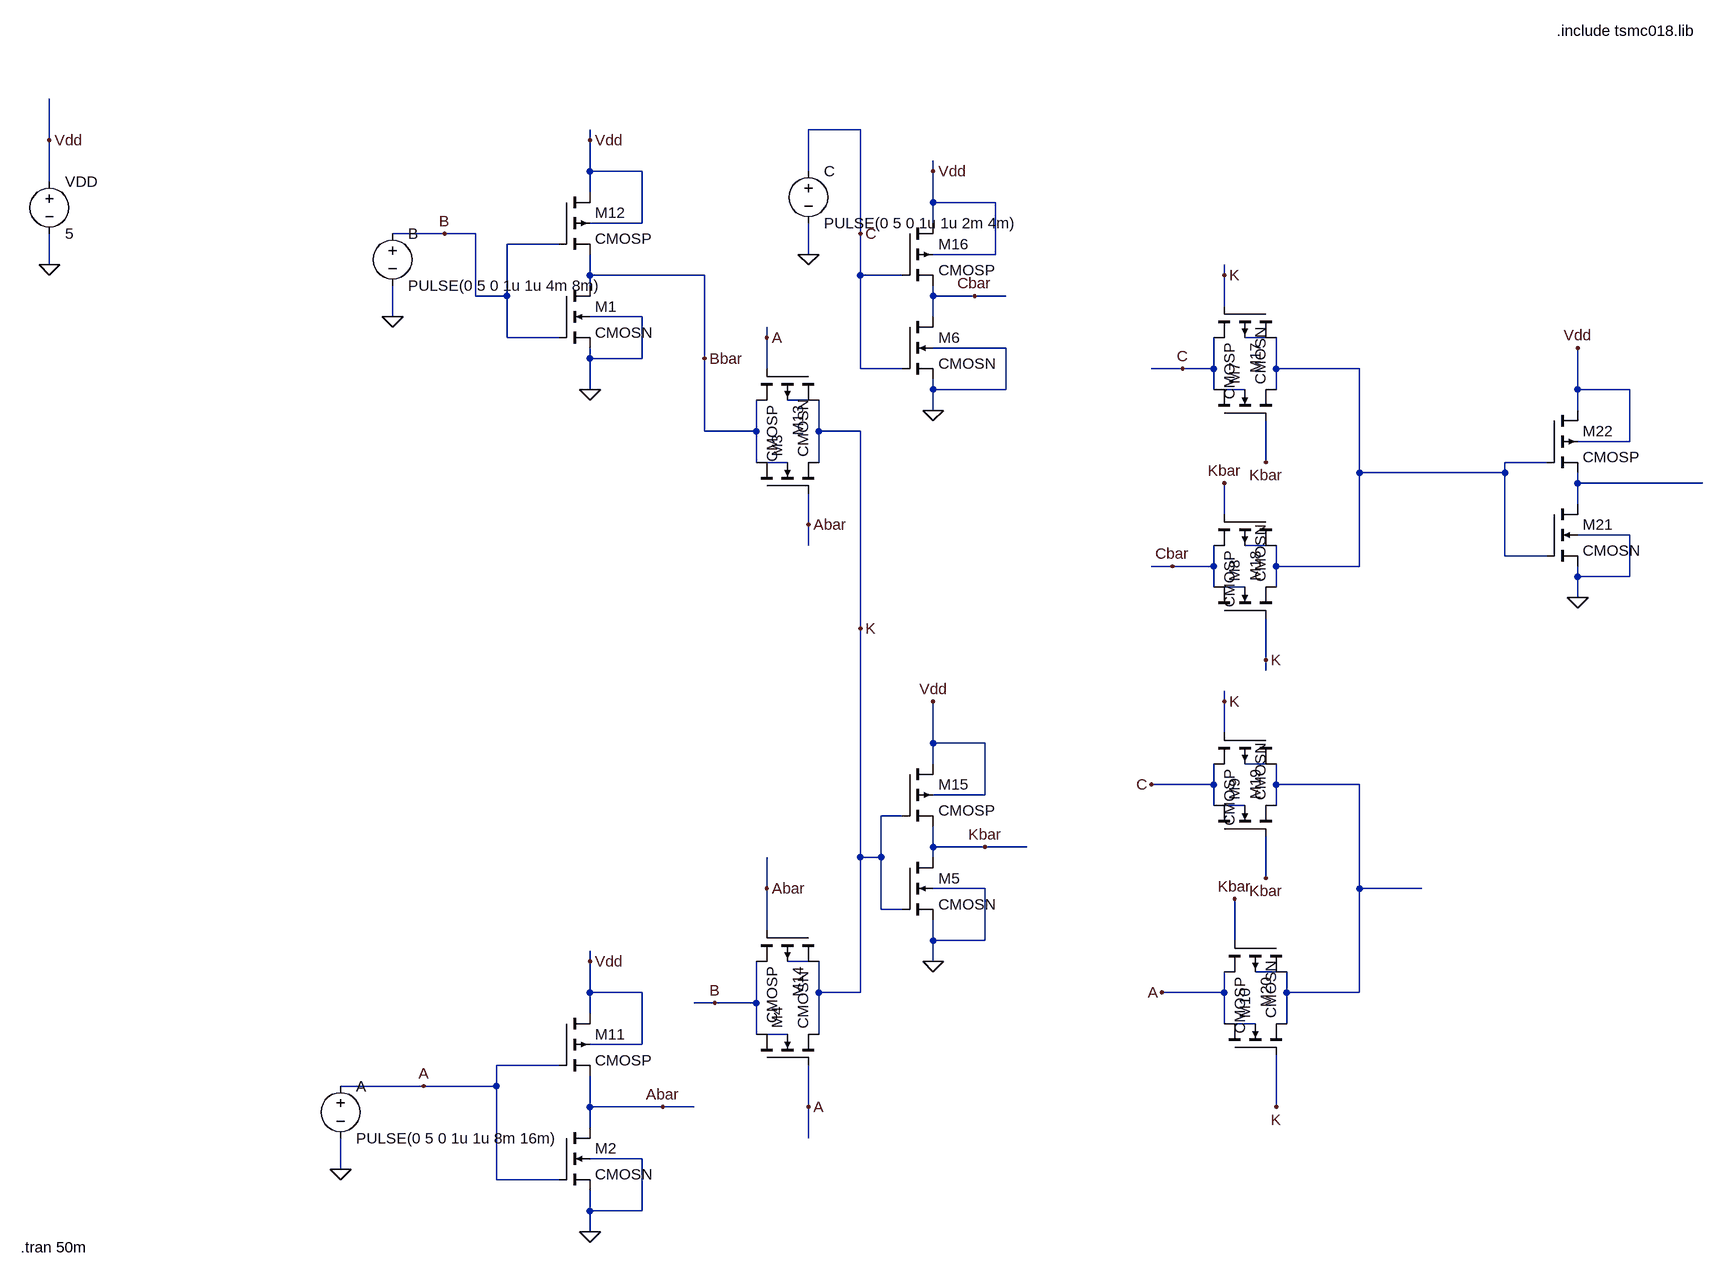
[diagram p0: schematic Full_adder_tg.asc]
Full_adder_tg.asc, the LTspice schematic file:
Version 4
SHEET 1 1788 1512
WIRE 480 -224 400 -224
WIRE -768 -208 -768 -272
WIRE 64 -208 64 -224
WIRE 64 -160 64 -208
WIRE 144 -160 64 -160
WIRE 400 -160 400 -224
WIRE 592 -160 592 -176
WIRE -768 -144 -768 -208
WIRE 64 -128 64 -160
WIRE 592 -112 592 -160
WIRE 688 -112 592 -112
WIRE 144 -80 144 -160
WIRE 144 -80 64 -80
WIRE 592 -80 592 -112
WIRE -160 -64 -240 -64
WIRE -112 -64 -160 -64
WIRE 480 -64 480 -224
WIRE 16 -48 -64 -48
WIRE 400 -32 400 -80
WIRE 688 -32 688 -112
WIRE 688 -32 592 -32
WIRE -768 -16 -768 -64
WIRE 64 0 64 -32
WIRE 240 0 64 0
WIRE 480 0 480 -64
WIRE 544 0 480 0
WIRE 1040 0 1040 -16
WIRE 64 16 64 0
WIRE -112 32 -112 -64
WIRE -64 32 -64 -48
WIRE -64 32 -112 32
WIRE 592 32 592 16
WIRE 656 32 592 32
WIRE 704 32 656 32
WIRE 1040 48 1040 0
WIRE -240 64 -240 16
WIRE 144 64 64 64
WIRE 592 64 592 32
WIRE -64 96 -64 32
WIRE 16 96 -64 96
WIRE 336 96 336 80
WIRE 1104 96 1104 80
WIRE 1104 96 1072 96
WIRE 704 112 592 112
WIRE 64 128 64 112
WIRE 144 128 144 64
WIRE 144 128 64 128
WIRE 240 128 240 0
WIRE 336 144 336 96
WIRE 480 144 480 0
WIRE 544 144 480 144
WIRE 976 144 928 144
WIRE 1024 144 1024 96
WIRE 1024 144 976 144
WIRE 1120 144 1120 96
WIRE 1248 144 1120 144
WIRE 64 176 64 128
WIRE 592 176 592 160
WIRE 704 176 704 112
WIRE 704 176 592 176
WIRE 1024 176 1024 144
WIRE 1072 176 1040 176
WIRE 1120 176 1120 144
WIRE 1584 176 1584 112
WIRE 1664 176 1584 176
WIRE 400 192 368 192
WIRE 592 208 592 176
WIRE 1584 208 1584 176
WIRE 240 240 240 128
WIRE 320 240 320 192
WIRE 320 240 240 240
WIRE 416 240 416 192
WIRE 480 240 416 240
WIRE 1664 256 1664 176
WIRE 1664 256 1584 256
WIRE 320 288 320 240
WIRE 368 288 336 288
WIRE 416 288 416 240
WIRE 1104 288 1104 224
WIRE 1536 288 1472 288
WIRE 1248 304 1248 144
WIRE 1472 304 1472 288
WIRE 1472 304 1248 304
WIRE 1584 320 1584 304
WIRE 1776 320 1584 320
WIRE 1584 352 1584 320
WIRE 1040 368 1040 320
WIRE 400 384 400 336
WIRE 1664 400 1584 400
WIRE 400 416 400 384
WIRE 1104 416 1072 416
WIRE 1472 432 1472 304
WIRE 1536 432 1472 432
WIRE 960 448 928 448
WIRE 1024 448 1024 416
WIRE 1024 448 960 448
WIRE 1120 448 1120 416
WIRE 1248 448 1248 304
WIRE 1248 448 1120 448
WIRE 1584 464 1584 448
WIRE 1664 464 1664 400
WIRE 1664 464 1584 464
WIRE 1024 480 1024 448
WIRE 1072 480 1040 480
WIRE 1120 480 1120 448
WIRE 1584 496 1584 464
WIRE 480 544 480 240
WIRE 1104 592 1104 528
WIRE 1104 608 1104 592
WIRE 1040 656 1040 640
WIRE 1040 704 1040 656
WIRE 592 720 592 656
WIRE 672 720 592 720
WIRE 592 752 592 720
WIRE 1104 752 1072 752
WIRE 1024 784 1024 752
WIRE 1024 784 928 784
WIRE 1120 784 1120 752
WIRE 1248 784 1120 784
WIRE 672 800 672 720
WIRE 672 800 592 800
WIRE 1024 816 1024 784
WIRE 1072 816 1040 816
WIRE 1120 816 1120 784
WIRE 544 832 512 832
WIRE 592 880 592 848
WIRE 672 880 592 880
WIRE 736 880 672 880
WIRE 480 896 480 544
WIRE 512 896 512 832
WIRE 512 896 480 896
WIRE 592 896 592 880
WIRE 1104 928 1104 864
WIRE 336 944 336 896
WIRE 672 944 592 944
WIRE 1248 944 1248 784
WIRE 1344 944 1248 944
WIRE 512 976 512 896
WIRE 544 976 512 976
WIRE 336 1008 336 944
WIRE 592 1024 592 992
WIRE 672 1024 672 944
WIRE 672 1024 592 1024
WIRE 1056 1024 1056 960
WIRE 64 1056 64 1040
WIRE 400 1056 368 1056
WIRE 592 1056 592 1024
WIRE 1120 1072 1088 1072
WIRE 64 1104 64 1056
WIRE 144 1104 64 1104
WIRE 416 1104 416 1056
WIRE 480 1104 480 896
WIRE 480 1104 416 1104
WIRE 1040 1104 1040 1072
WIRE 1040 1104 944 1104
WIRE 1136 1104 1136 1072
WIRE 1248 1104 1248 944
WIRE 1248 1104 1136 1104
WIRE 256 1120 224 1120
WIRE 320 1120 320 1056
WIRE 320 1120 256 1120
WIRE 64 1136 64 1104
WIRE 1040 1152 1040 1104
WIRE 1088 1152 1056 1152
WIRE 1136 1152 1136 1104
WIRE 320 1168 320 1120
WIRE 368 1168 336 1168
WIRE 416 1168 416 1104
WIRE 144 1184 144 1104
WIRE 144 1184 64 1184
WIRE 16 1216 -80 1216
WIRE -192 1248 -320 1248
WIRE -80 1248 -80 1216
WIRE -80 1248 -192 1248
WIRE 64 1280 64 1232
WIRE 176 1280 64 1280
WIRE 224 1280 176 1280
WIRE 400 1280 400 1216
WIRE 1120 1280 1120 1200
WIRE 64 1312 64 1280
WIRE 400 1328 400 1280
WIRE 144 1360 64 1360
WIRE -320 1376 -320 1328
WIRE -80 1392 -80 1248
WIRE 16 1392 -80 1392
WIRE 64 1440 64 1408
WIRE 144 1440 144 1360
WIRE 144 1440 64 1440
WIRE 64 1472 64 1440
FLAG 64 176 0
FLAG -240 64 0
FLAG -768 -16 0
FLAG -320 1376 0
FLAG 64 1472 0
FLAG 592 208 0
FLAG 592 1056 0
FLAG 400 -32 0
FLAG -768 -208 Vdd
FLAG 592 -160 Vdd
FLAG 64 -208 Vdd
FLAG 64 1056 Vdd
FLAG -192 1248 A
FLAG 336 96 A
FLAG 176 1280 Abar
FLAG 336 944 Abar
FLAG 400 384 Abar
FLAG 256 1120 B
FLAG -160 -64 B
FLAG 400 1280 A
FLAG 240 128 Bbar
FLAG 592 656 Vdd
FLAG 480 544 K
FLAG 1056 960 Kbar
FLAG 1104 928 Kbar
FLAG 672 880 Kbar
FLAG 1040 656 K
FLAG 1120 1280 K
FLAG 480 -64 C
FLAG 928 784 C
FLAG 944 1104 A
FLAG 1104 592 K
FLAG 1040 0 K
FLAG 1104 288 Kbar
FLAG 1040 320 Kbar
FLAG 656 32 Cbar
FLAG 960 448 Cbar
FLAG 976 144 C
FLAG 1584 496 0
FLAG 1584 112 Vdd
SYMBOL cmosn 16 16 R0
SYMATTR InstName M1
SYMBOL cmosn 16 1312 R0
SYMATTR InstName M2
SYMBOL cmosn 320 336 R270
SYMATTR InstName M3
SYMBOL cmosn 320 1216 R270
SYMATTR InstName M4
SYMBOL cmosn 544 896 R0
SYMATTR InstName M5
SYMBOL cmosn 544 64 R0
SYMATTR InstName M6
SYMBOL cmosn 1024 224 R270
SYMATTR InstName M7
SYMBOL cmosn 1024 528 R270
SYMATTR InstName M8
SYMBOL cmosn 1024 864 R270
SYMATTR InstName M9
SYMBOL cmosn 1040 1200 R270
SYMATTR InstName M10
SYMBOL cmosp 16 1136 R0
SYMATTR InstName M11
SYMBOL cmosp 16 -128 R0
SYMATTR InstName M12
SYMBOL cmosp 416 144 R90
SYMATTR InstName M13
SYMBOL cmosp 416 1008 R90
SYMATTR InstName M14
SYMBOL cmosp 544 752 R0
SYMATTR InstName M15
SYMBOL cmosp 544 -80 R0
SYMATTR InstName M16
SYMBOL cmosp 1120 48 R90
SYMATTR InstName M17
SYMBOL cmosp 1120 368 R90
SYMATTR InstName M18
SYMBOL cmosp 1120 704 R90
SYMATTR InstName M19
SYMBOL cmosp 1136 1024 R90
SYMATTR InstName M20
SYMBOL voltage -320 1232 R0
WINDOW 123 0 0 Left 0
WINDOW 39 0 0 Left 0
SYMATTR InstName A
SYMATTR Value PULSE(0 5 0 1u 1u 8m 16m)
SYMBOL voltage -240 -80 R0
WINDOW 123 0 0 Left 0
WINDOW 39 0 0 Left 0
SYMATTR InstName B
SYMATTR Value PULSE(0 5 0 1u 1u 4m 8m)
SYMBOL voltage 400 -176 R0
WINDOW 123 0 0 Left 0
WINDOW 39 0 0 Left 0
SYMATTR InstName C
SYMATTR Value PULSE(0 5 0 1u 1u 2m 4m)
SYMBOL voltage -768 -160 R0
WINDOW 123 0 0 Left 0
WINDOW 39 0 0 Left 0
SYMATTR InstName VDD
SYMATTR Value 5
SYMBOL cmosn 1536 352 R0
SYMATTR InstName M21
SYMBOL cmosp 1536 208 R0
SYMATTR InstName M22
TEXT 1552 -376 Left 2 !.include tsmc018.lib
TEXT -812 1496 Left 2 !.tran 50m

The netlist it stands for:
* Full_adder_tg.asc
M1 Bbar B 0 0 CMOSN
M2 Abar A 0 0 CMOSN
M3 Bbar Abar K N005 CMOSN
M4 B A K N015 CMOSN
M5 Kbar K 0 0 CMOSN
M6 Cbar C 0 0 CMOSN
M7 C Kbar N002 N003 CMOSN
M8 Cbar K N002 N008 CMOSN
M9 C Kbar N010 N011 CMOSN
M10 A K N010 N014 CMOSN
M11 Vdd A Abar Vdd CMOSP
M12 Vdd B Bbar Vdd CMOSP
M13 K A Bbar N004 CMOSP
M14 K Abar B N012 CMOSP
M15 Vdd K Kbar Vdd CMOSP
M16 Vdd C Cbar Vdd CMOSP
M17 N002 K C N001 CMOSP
M18 N002 Kbar Cbar N007 CMOSP
M19 N010 K C N009 CMOSP
M20 N010 Kbar A N013 CMOSP
V§A A 0 PULSE(0 5 0 1u 1u 8m 16m)
V§B B 0 PULSE(0 5 0 1u 1u 4m 8m)
V§C C 0 PULSE(0 5 0 1u 1u 2m 4m)
VDD Vdd 0 5
M21 N006 N002 0 0 CMOSN
M22 Vdd N002 N006 Vdd CMOSP
.model NMOS NMOS
.model PMOS PMOS
.lib standard.mos
.include tsmc018.lib
.tran 50m
.backanno
.end